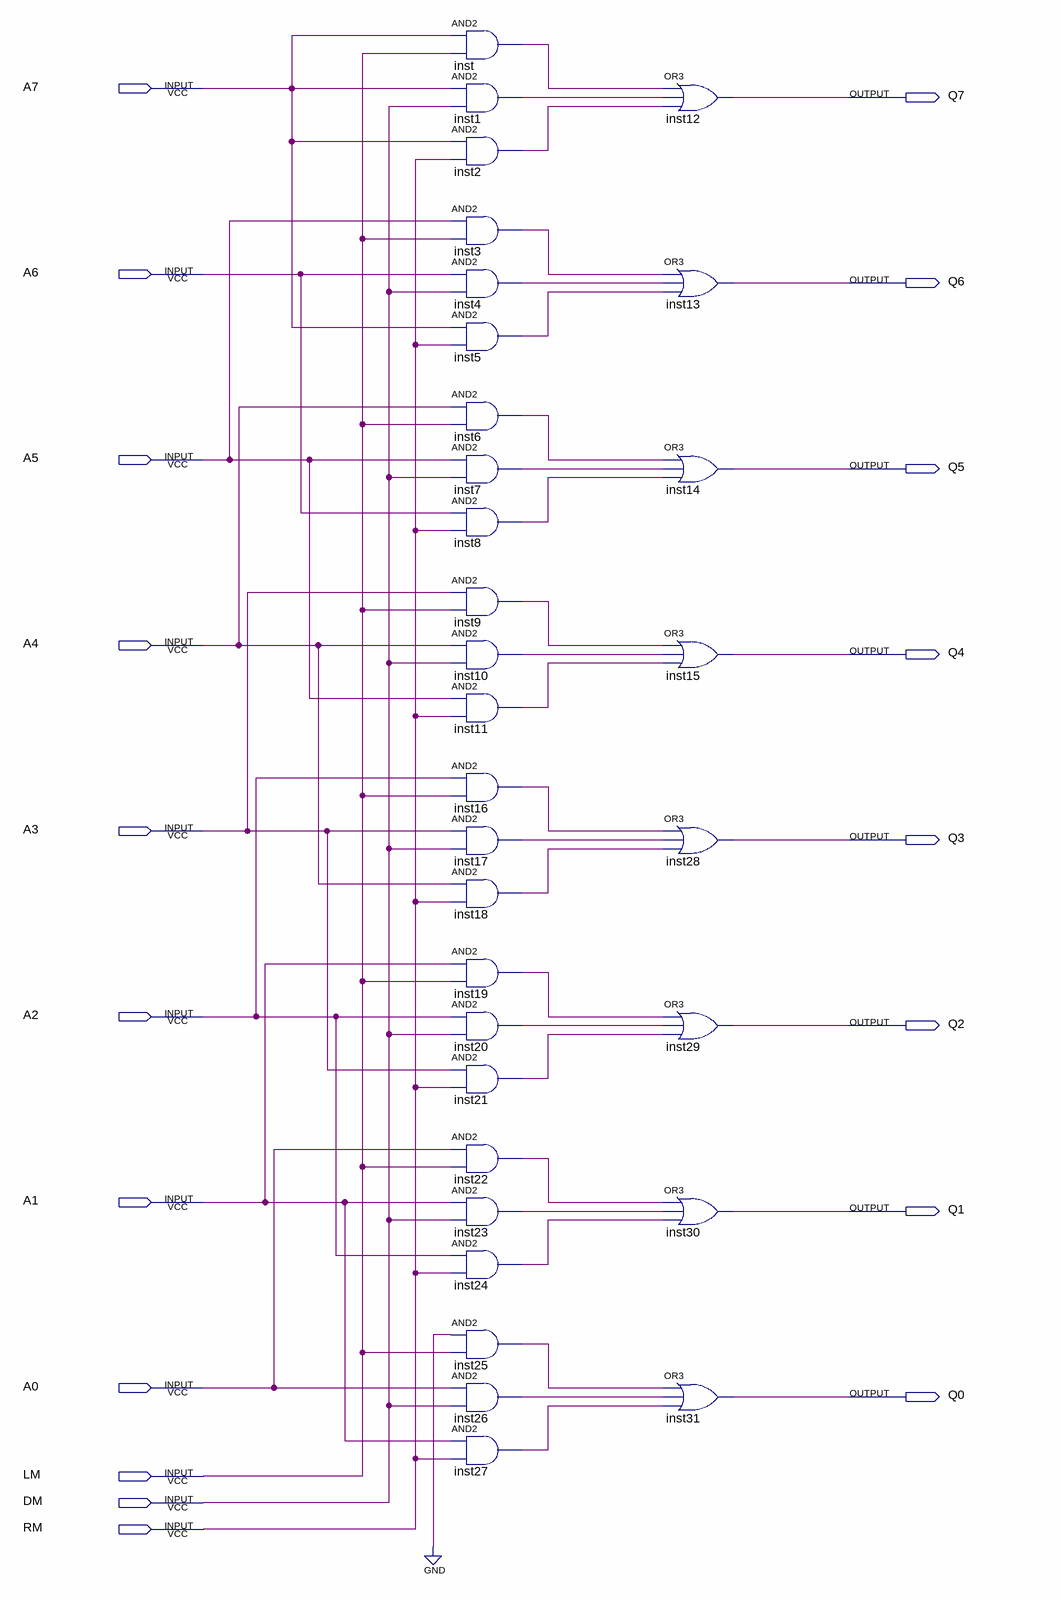
[diagram p0: schematic sheet]
// Quartus schematic com-shifter-8.bdf as structural Verilog: 32 symbols, 19 pins
module \com-shifter-8  (
  input  A7,
  input  A6,
  input  A5,
  input  A4,
  input  A3,
  input  A2,
  input  A1,
  input  A0,
  input  LM,
  input  DM,
  input  RM,
  output Q7,
  output Q6,
  output Q5,
  output Q4,
  output Q3,
  output Q2,
  output Q1,
  output Q0
);

  wire inst1_out, inst2_out, inst3_out, inst4_out, inst5_out, inst6_out, inst7_out, inst8_out, inst9_out,
       inst10_out, inst11_out, inst16_out, inst17_out, inst18_out, inst19_out, inst20_out, inst21_out,
       inst22_out, inst23_out, inst24_out, inst25_out, inst26_out, inst27_out, inst_out;

  and inst (inst_out, A7, LM);
  and inst1 (inst1_out, A7, DM);
  and inst2 (inst2_out, A7, RM);
  and inst3 (inst3_out, A5, LM);
  and inst4 (inst4_out, A6, DM);
  and inst5 (inst5_out, A7, RM);
  and inst6 (inst6_out, A4, LM);
  and inst7 (inst7_out, A5, DM);
  and inst8 (inst8_out, A6, RM);
  and inst9 (inst9_out, A3, LM);
  and inst10 (inst10_out, A4, DM);
  and inst11 (inst11_out, A5, RM);
  and inst16 (inst16_out, A2, LM);
  and inst17 (inst17_out, A3, DM);
  and inst18 (inst18_out, A4, RM);
  and inst19 (inst19_out, A1, LM);
  and inst20 (inst20_out, A2, DM);
  and inst21 (inst21_out, A3, RM);
  and inst22 (inst22_out, A0, LM);
  and inst23 (inst23_out, A1, DM);
  and inst24 (inst24_out, A2, RM);
  and inst25 (inst25_out, 1'b0, LM);
  and inst26 (inst26_out, A0, DM);
  and inst27 (inst27_out, A1, RM);
  or inst12 (Q7, inst_out, inst1_out, inst2_out);
  or inst13 (Q6, inst3_out, inst4_out, inst5_out);
  or inst14 (Q5, inst6_out, inst7_out, inst8_out);
  or inst15 (Q4, inst9_out, inst10_out, inst11_out);
  or inst28 (Q3, inst16_out, inst17_out, inst18_out);
  or inst29 (Q2, inst19_out, inst20_out, inst21_out);
  or inst30 (Q1, inst22_out, inst23_out, inst24_out);
  or inst31 (Q0, inst25_out, inst26_out, inst27_out);
endmodule
